# Altium project ZGAD250D12.PrjPCB
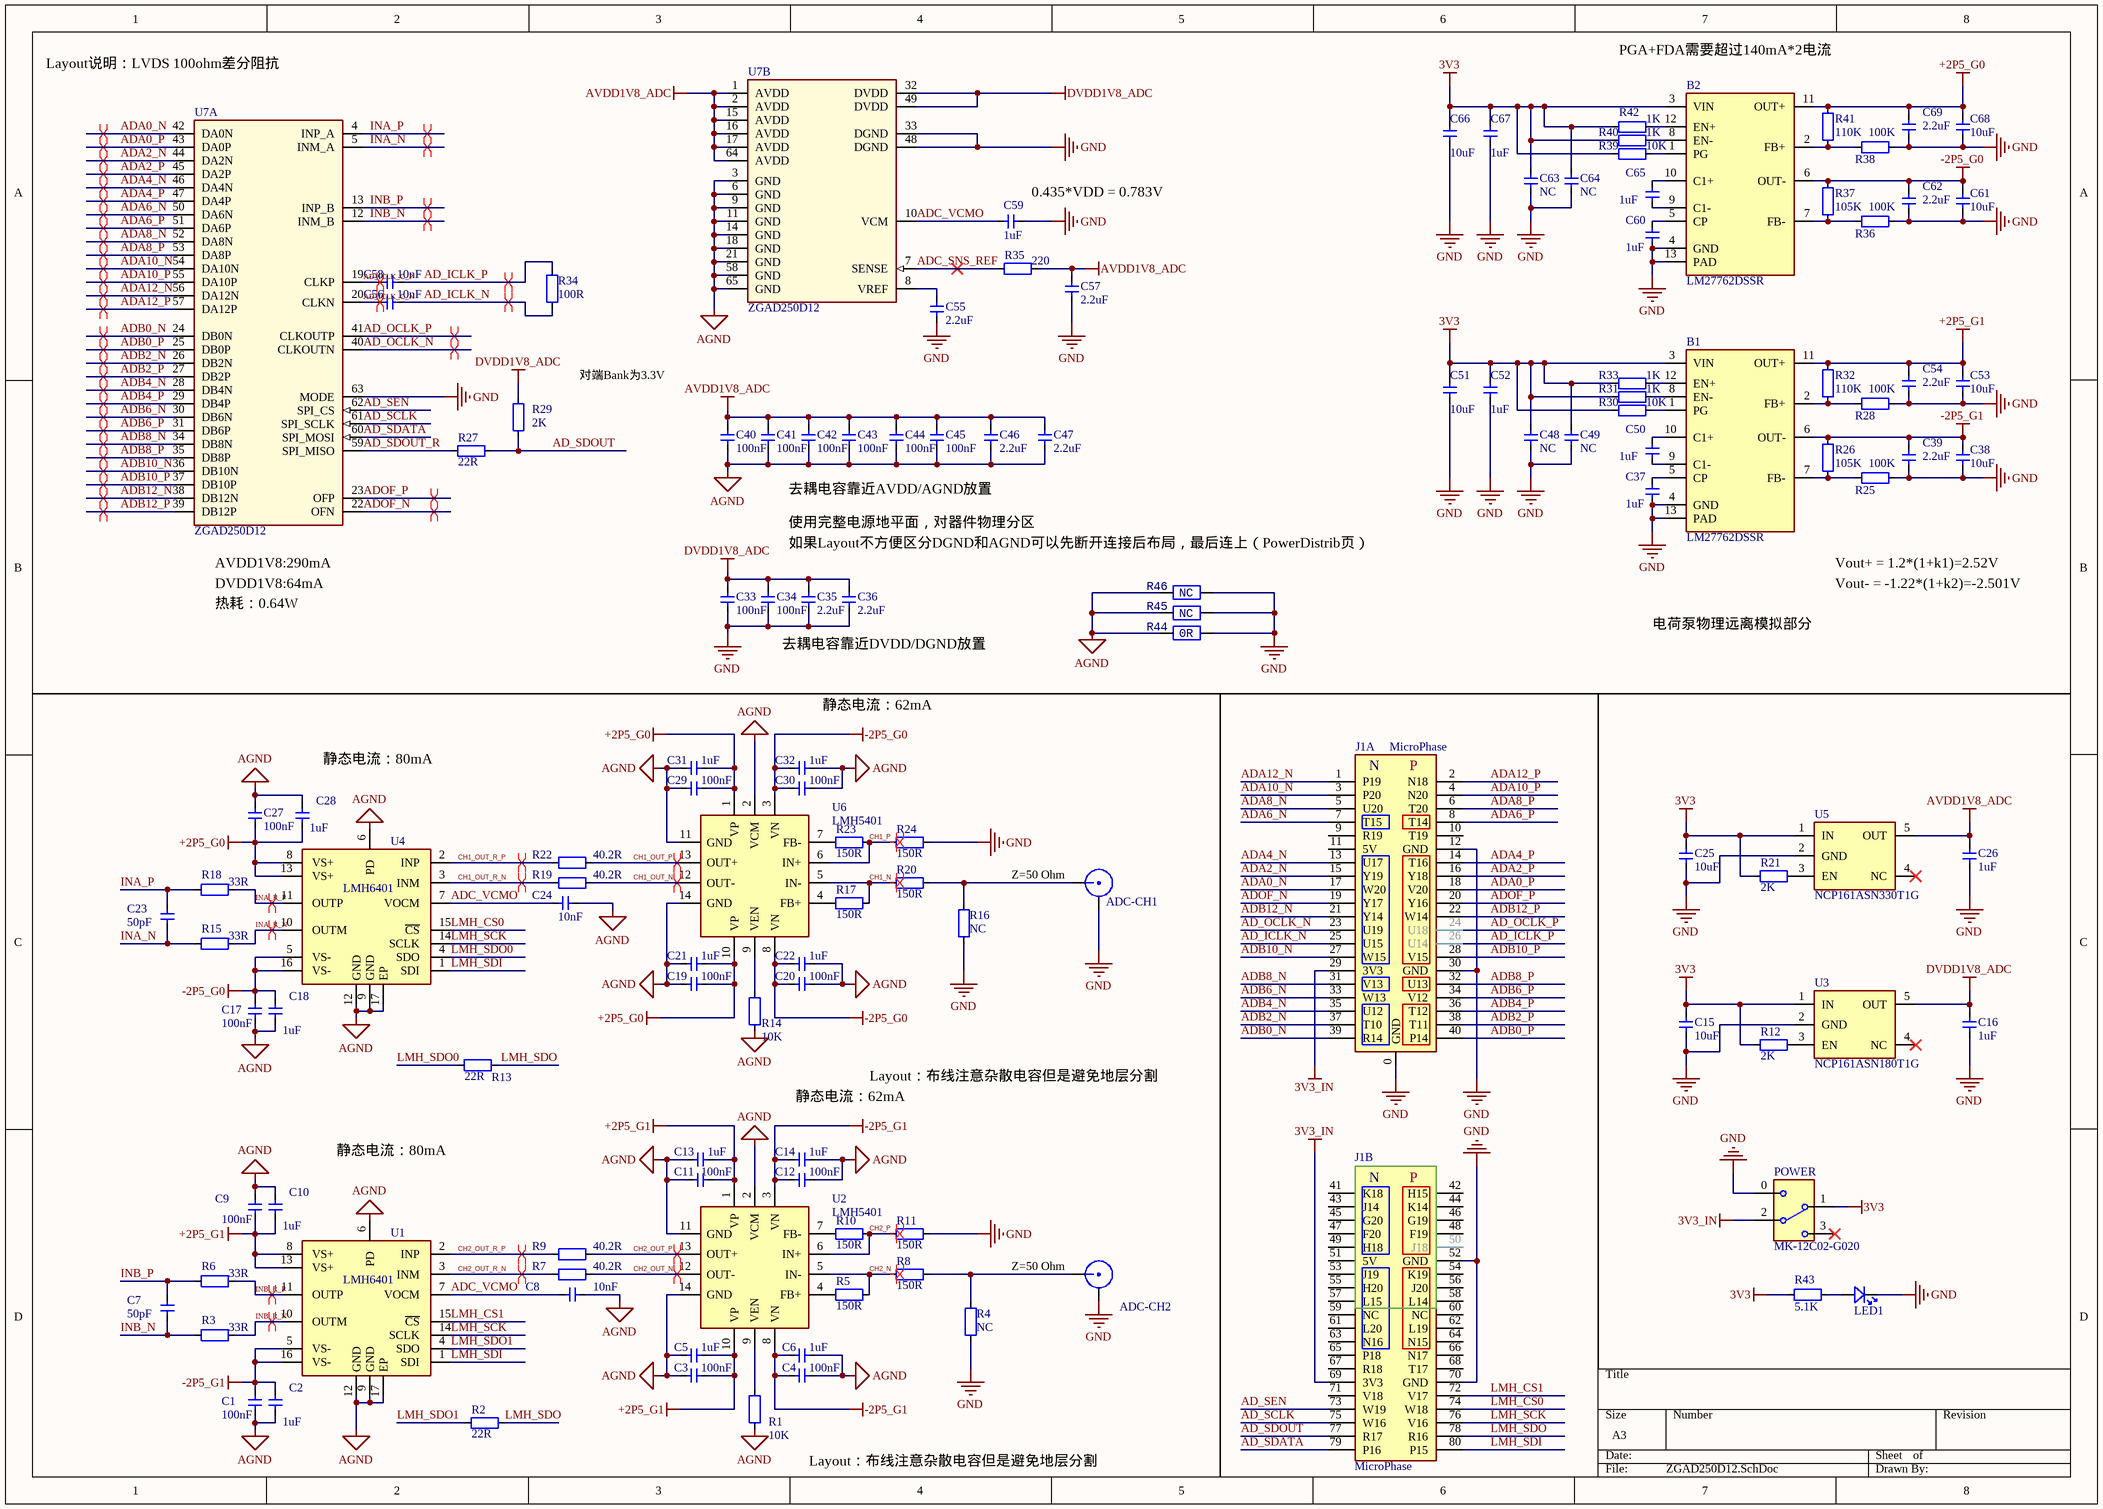
[diagram p0: ZGAD250D12.SchDoc]
1 sheet, 129 parts. Net scope: global (net labels, ports and power ports of the same name join across sheets).
Board file: ZGAD250D12.PcbDoc

## Sheet ZGAD250D12.SchDoc
size A3

### Parts
ADC-CH1  SMA  [SMA-KHD]  (value not drawn)
ADC-CH2  SMA  [SMA-KHD]  (value not drawn)
B1  LM27762DSSR  [SON50P200X300X80-13N-D]
B2  LM27762DSSR  [SON50P200X300X80-13N-D]
C1  100nF  [C 0201]
C2  1uF  [C 0402]
C3  100nF  [C 0201]
C4  100nF  [C 0201]
C5  1uF  [C 0402]
C6  1uF  [C 0402]
C7  50pF  [C 0201]
C8  10nF  [C 0201]
C9  100nF  [C 0201]
C10  1uF  [C 0402]
C11  100nF  [C 0201]
C12  100nF  [C 0201]
C13  1uF  [C 0402]
C14  1uF  [C 0402]
C15  10uF  [C 0603]
C16  1uF  [C 0402]
C17  100nF  [C 0201]
C18  1uF  [C 0402]
C19  100nF  [C 0201]
C20  100nF  [C 0201]
C21  1uF  [C 0402]
C22  1uF  [C 0402]
C23  50pF  [C 0201]
C24  10nF  [C 0201]
C25  10uF  [C 0603]
C26  1uF  [C 0402]
C27  100nF  [C 0201]
C28  1uF  [C 0402]
C29  100nF  [C 0201]
C30  100nF  [C 0201]
C31  1uF  [C 0402]
C32  1uF  [C 0402]
C33  100nF  [C 0201]
C34  100nF  [C 0201]
C35  2.2uF  [C 0603]
C36  2.2uF  [C 0603]
C37  1uF  [C 0402]
C38  10uF  [C 0603]
C39  2.2uF  [C 0402]
C40  100nF  [C 0201]
C41  100nF  [C 0201]
C42  100nF  [C 0201]
C43  100nF  [C 0201]
C44  100nF  [C 0201]
C45  100nF  [C 0201]
C46  2.2uF  [C 0603]
C47  2.2uF  [C 0603]
C48  NC  [C 0201]
C49  NC  [C 0201]
C50  1uF  [C 0402]
C51  10uF  [C 0603]
C52  1uF  [C 0402]
C53  10uF  [C 0603]
C54  2.2uF  [C 0402]
C55  2.2uF  [C 0603]
C56  10nF  [C 0201]
C57  2.2uF  [C 0603]
C58  10nF  [C 0201]
C59  1uF  [C 0402]
C60  1uF  [C 0402]
C61  10uF  [C 0603]
C62  2.2uF  [C 0402]
C63  NC  [C 0201]
C64  NC  [C 0201]
C65  1uF  [C 0402]
C66  10uF  [C 0603]
C67  1uF  [C 0402]
C68  10uF  [C 0603]
C69  2.2uF  [C 0402]
J1  MicroPhase  [MicroPhase]  (parts A,B of 2)
LED1  LED-SMD  [LED 0603W]  (value not drawn)
POWER  MK-12C02-G020  [MSK-12C01-07]
R1  10K  [R 0201]
R2  22R  [R 0201]
R3  33R  [R 0402]
R4  NC  [R 0201]
R5  150R  [R 0201]
R6  33R  [R 0402]
R7  40.2R  [R 0201]
R8  150R  [R 0201]
R9  40.2R  [R 0201]
R10  150R  [R 0201]
R11  150R  [R 0201]
R12  2K  [R 0402]
R13  22R  [R 0201]
R14  10K  [R 0201]
R15  33R  [R 0402]
R16  NC  [R 0201]
R17  150R  [R 0201]
R18  33R  [R 0402]
R19  40.2R  [R 0201]
R20  150R  [R 0201]
R21  2K  [R 0402]
R22  40.2R  [R 0201]
R23  150R  [R 0201]
R24  150R  [R 0201]
R25  100K  [R 0402]
R26  105K  [R 0402]
R27  22R  [R 0201]
R28  100K  [R 0402]
R29  2K  [R 0201]
R30  10K  [R 0402]
R31  1K  [R 0402]
R32  110K  [R 0402]
R33  1K  [R 0402]
R34  100R  [R 0201]
R35  220  [R 0201]
R36  100K  [R 0402]
R37  105K  [R 0402]
R38  100K  [R 0402]
R39  10K  [R 0402]
R40  1K  [R 0402]
R41  110K  [R 0402]
R42  1K  [R 0402]
R43  5.1K  [R 0402]
R44  0R  [R_0603]
R45  NC  [R_0603]
R46  NC  [R_0603]
U1  LMH6401  [LMH6401IRMZT]
U2  LMH5401  [LMH5401IRMSR]
U3  NCP161ASN180T1G  [SOT23-5L]
U4  LMH6401  [LMH6401IRMZT]
U5  NCP161ASN330T1G  [SOT23-5L]
U6  LMH5401  [LMH5401IRMSR]
U7  ZGAD250D12  [QFN64 9x9_L]  (parts A,B of 2)

### Nets
3V3: B1.3(VIN) B2.3(VIN) C15.2 C25.2 C48.2 C49.2 C51.2 C52.2 C63.2 C64.2 C66.2 C67.2 POWER.1 R12.2 R21.2 R30.1 R31.1 R33.1 R39.1 R40.1 R42.1 R43.1 U3.1(IN) U5.1(IN)
3V3_IN: J1.29(3V3) J1.69(3V3) POWER.2
+2P5_G0: B2.11(OUT+) C19.1 C21.1 C27.1 C28.1 C29.1 C31.1 C68.2 C69.2 R41.2 U4.8(VS+) U4.13(VS+) U6.1(VP) U6.10(VP)
+2P5_G1: B1.11(OUT+) C3.1 C5.1 C9.1 C10.1 C11.1 C13.1 C53.2 C54.2 R32.2 U1.8(VS+) U1.13(VS+) U2.1(VP) U2.10(VP)
-2P5_G0: B2.6(OUT-) C17.2 C18.2 C20.2 C22.2 C30.2 C32.2 C61.2 C62.2 R37.2 U4.5(VS-) U4.16(VS-) U6.3(VN) U6.8(VN)
-2P5_G1: B1.6(OUT-) C1.2 C2.2 C4.2 C6.2 C12.2 C14.2 C38.2 C39.2 R26.2 U1.5(VS-) U1.16(VS-) U2.3(VN) U2.8(VN)
AGND: C1.1 C2.1 C3.2 C4.1 C5.2 C6.1 C8.1 C9.2 C10.2 C11.2 C12.1 C13.2 C14.1 C17.1 C18.1 C19.2 C20.1 C21.2 C22.1 C24.1 C27.2 C28.2 C29.2 C30.1 C31.2 C32.1 C40.1 C41.1 C42.1 C43.1 C44.1 C45.1 C46.1 C47.1 R1.1 R14.1 R44.2 R45.2 R46.2 U1.6(PD) U1.9(GND) U1.12(GND) U1.17(EP) U2.2(VCM) U2.11(GND) U2.14(GND) U4.6(PD) U4.9(GND) U4.12(GND) U4.17(EP) U6.2(VCM) U6.11(GND) U6.14(GND) U7.3(GND) U7.6(GND) U7.9(GND) U7.11(GND) U7.14(GND) U7.18(GND) U7.21(GND) U7.58(GND) U7.65(GND)
AVDD1V8_ADC: C26.2 C40.2 C41.2 C42.2 C43.2 C44.2 C45.2 C46.2 C47.2 C57.2 R35.2 U5.5(OUT) U7.1(AVDD) U7.2(AVDD) U7.15(AVDD) U7.16(AVDD) U7.17(AVDD) U7.64(AVDD)
DVDD1V8_ADC: C16.2 C33.2 C34.2 C35.2 C36.2 R29.1 U3.5(OUT) U7.32(DVDD) U7.49(DVDD)
GND: ADC-CH1.2(GND) ADC-CH2.2(GND) B1.4(GND) B1.13(PAD) B2.4(GND) B2.13(PAD) C15.1 C16.1 C25.1 C26.1 C33.1 C34.1 C35.1 C36.1 C37.1 C38.1 C39.1 C48.1 C49.1 C51.1 C52.1 C53.1 C54.1 C55.1 C57.1 C59.1 C60.1 C61.1 C62.1 C63.1 C64.1 C66.1 C67.1 C68.1 C69.1 J1.0(GND) J1.12(GND) J1.30(GND) J1.52(GND) J1.70(GND) LED1.2 POWER.0 R4.2 R11.2 R16.2 R24.2 R25.1 R28.1 R36.1 R38.1 R44.1 R45.1 R46.1 U3.2(GND) U5.2(GND) U7.33(DGND) U7.48(DGND) U7.63(MODE)
AD_ICLK_C_N: C56.2 U7.20(CLKN)
AD_ICLK_C_P: C58.2 U7.19(CLKP)
AD_ICLK_N: C56.1 J1.25(U15) R34.1
AD_ICLK_P: C58.1 J1.26(U14) R34.2
AD_OCLK_N: J1.23(U19) U7.40(CLKOUTN)
AD_OCLK_P: J1.24(U18) U7.41(CLKOUTP)
AD_SCLK: J1.75(W16) U7.61(SPI_SCLK)
AD_SDATA: J1.79(P16) U7.60(SPI_MOSI)
AD_SDOUT: J1.77(R17) R27.1 R29.2
AD_SDOUT_R: R27.2 U7.59(SPI_MISO)
AD_SEN: J1.73(W19) U7.62(SPI_CS)
ADA0_N: J1.17(W20) U7.42(DA0N)
ADA0_P: J1.18(V20) U7.43(DA0P)
ADA2_N: J1.15(Y19) U7.44(DA2N)
ADA2_P: J1.16(Y18) U7.45(DA2P)
ADA4_N: J1.13(U17) U7.46(DA4N)
ADA4_P: J1.14(T16) U7.47(DA4P)
ADA6_N: J1.7(T15) U7.50(DA6N)
ADA6_P: J1.8(T14) U7.51(DA6P)
ADA8_N: J1.5(U20) U7.52(DA8N)
ADA8_P: J1.6(T20) U7.53(DA8P)
ADA10_N: J1.3(P20) U7.54(DA10N)
ADA10_P: J1.4(N20) U7.55(DA10P)
ADA12_N: J1.1(P19) U7.56(DA12N)
ADA12_P: J1.2(N18) U7.57(DA12P)
ADB0_N: J1.39(R14) U7.24(DB0N)
ADB0_P: J1.40(P14) U7.25(DB0P)
ADB2_N: J1.37(T10) U7.26(DB2N)
ADB2_P: J1.38(T11) U7.27(DB2P)
ADB4_N: J1.35(U12) U7.28(DB4N)
ADB4_P: J1.36(T12) U7.29(DB4P)
ADB6_N: J1.33(W13) U7.30(DB6N)
ADB6_P: J1.34(V12) U7.31(DB6P)
ADB8_N: J1.31(V13) U7.34(DB8N)
ADB8_P: J1.32(U13) U7.35(DB8P)
ADB10_N: J1.27(W15) U7.36(DB10N)
ADB10_P: J1.28(V15) U7.37(DB10P)
ADB12_N: J1.21(Y14) U7.38(DB12N)
ADB12_P: J1.22(W14) U7.39(DB12P)
ADC_SNS_REF: R35.1 U7.7(SENSE)
ADC_VCMO: C8.2 C24.2 C59.2 U1.7(VOCM) U4.7(VOCM) U7.10(VCM)
ADOF_N: J1.19(Y17) U7.22(OFN)
ADOF_P: J1.20(Y16) U7.23(OFP)
CH1_N: R17.1 R20.2 U6.5(IN-)
CH1_OUT_N: R19.1 U6.12(OUT-)
CH1_OUT_P: R22.1 U6.13(OUT+)
CH1_OUT_R_N: R19.2 U4.3(INM)
CH1_OUT_R_P: R22.2 U4.2(INP)
CH1_P: R23.1 R24.1 U6.6(IN+)
CH2_N: R5.1 R8.2 U2.5(IN-)
CH2_OUT_N: R7.1 U2.12(OUT-)
CH2_OUT_P: R9.1 U2.13(OUT+)
CH2_OUT_R_N: R7.2 U1.3(INM)
CH2_OUT_R_P: R9.2 U1.2(INP)
CH2_P: R10.1 R11.1 U2.6(IN+)
INA_N: C23.1 R15.2 U7.5(INM_A)
INA_P: C23.2 R18.2 U7.4(INP_A)
INA_R_N: R15.1 U4.10(OUTM)
INA_R_P: R18.1 U4.11(OUTP)
INB_N: C7.1 R3.2 U7.12(INM_B)
INB_P: C7.2 R6.2 U7.13(INP_B)
INB_R_N: R3.1 U1.10(OUTM)
INB_R_P: R6.1 U1.11(OUTP)
LMH_CS0: J1.74(W18) U4.15(~{CS})
LMH_CS1: J1.72(V17) U1.15(~{CS})
LMH_SCK: J1.76(V16) U1.14(SCLK) U4.14(SCLK)
LMH_SDI: J1.80(P15) U1.1(SDI) U4.1(SDI)
LMH_SDO: J1.78(R16) R2.1 R13.1
LMH_SDO0: R13.2 U4.4(SDO)
LMH_SDO1: R2.2 U1.4(SDO)
NetADC-CH1_1: ADC-CH1.1(IN) R16.1 R20.1
NetADC-CH2_1: ADC-CH2.1(IN) R4.1 R8.1
NetB1_1: B1.1(PG) R30.2
NetB1_2: B1.2(FB+) R28.2 R32.1
NetB1_5: B1.5(CP) C37.2
NetB1_7: B1.7(FB-) R25.2 R26.1
NetB1_8: B1.8(EN-) R31.2
NetB1_9: B1.9(C1-) C50.1
NetB1_10: B1.10(C1+) C50.2
NetB1_12: B1.12(EN+) R33.2
NetB2_1: B2.1(PG) R39.2
NetB2_2: B2.2(FB+) R38.2 R41.1
NetB2_5: B2.5(CP) C60.2
NetB2_7: B2.7(FB-) R36.2 R37.1
NetB2_8: B2.8(EN-) R40.2
NetB2_9: B2.9(C1-) C65.1
NetB2_10: B2.10(C1+) C65.2
NetB2_12: B2.12(EN+) R42.2
NetC55_2: C55.2 U7.8(VREF)
NetLED1_1: LED1.1 R43.2
NetR1_2: R1.2 U2.9(VEN)
NetR5_2: R5.2 U2.4(FB+)
NetR10_2: R10.2 U2.7(FB-)
NetR12_1: R12.1 U3.3(EN)
NetR14_2: R14.2 U6.9(VEN)
NetR17_2: R17.2 U6.4(FB+)
NetR21_1: R21.1 U5.3(EN)
NetR23_2: R23.2 U6.7(FB-)

Not connected (* = marked no-connect by the designer): J1 9(R19) 10(T19) 11(5V) 41(K18) 42(H15) 43(J14) 44(K14) 45(G20) 46(G19) 47(F20) 48(F19) 49(H18) 50(J18) 51(5V) 53(J19) 54(K19) 55(H20) 56(J20) 57(L15) 58(L14) 59(NC) 60(NC) 61(L20) 62(L19) 63(N16) 64(N15) 65(P18) 66(N17) 67(R18) 68(T17) 71(V18); POWER 3*; U3 4(NC)*; U5 4(NC)*

### Layout directives
differential pair: AD_ICLK_C_N, AD_ICLK_C_P, AD_ICLK_N, AD_ICLK_P, AD_OCLK_N, AD_OCLK_P, ADA0_N, ADA0_P, ADA2_N, ADA2_P, ADA4_N, ADA4_P, ADA6_N, ADA6_P, ADA8_N, ADA8_P, ADA10_N, ADA10_P, ADA12_N, ADA12_P, ADB0_N, ADB0_P, ADB2_N, ADB2_P, ADB4_N, ADB4_P, ADB6_N, ADB6_P, ADB8_N, ADB8_P, ADB10_N, ADB10_P, ADB12_N, ADB12_P, ADOF_N, ADOF_P, CH1_N, CH1_OUT_N, CH1_OUT_P, CH1_OUT_R_N, CH1_OUT_R_P, CH1_P, CH2_N, CH2_OUT_N, CH2_OUT_P, CH2_OUT_R_N, CH2_OUT_R_P, CH2_P, INA_N, INA_P, INA_R_N, INA_R_P, INB_N, INB_P, INB_R_N, INB_R_P

### Notes on the sheet
- Layout说明：LVDS 100ohm差分阻抗
- PGA+FDA需要超过140mA*2电流
- (near C59) 0.435*VDD = 0.783V
- 对端Bank为3.3V
- 去耦电容靠近AVDD/AGND放置
- (near U7) AVDD1V8:290mA
- DVDD1V8:64mA
- 如果Layout不方便区分DGND和AGND可以先断开连接后布局，最后连上（PowerDistrib页）
- 使用完整电源地平面，对器件物理分区
- Vout+ = 1.2*(1+k1)=2.52V
- Vout- = -1.22*(1+k2)=-2.501V
- 热耗：0.64W
- 去耦电容靠近DVDD/DGND放置
- 电荷泵物理远离模拟部分
- 静态电流：62mA
- (near C28) 静态电流：80mA
- (near ADC-CH1) Z=50 Ohm
- Layout：布线注意杂散电容但是避免地层分割
- 静态电流：80mA
- (near ADC-CH2) Z=50 Ohm
- (in symbol MicroPhase, part A) N; P
- (in symbol MicroPhase, part B) N; P

### Library data of the parts
ADC-CH1 ADC-CH2 = SMA: SMA射频接口
B1 B2 = LM27762DSSR: LDO Voltage Regulators Low-Noise Positive- and Negative-Output Integrated Switched Capacitor Plus LDO 12-WSON -40 to 85; Manufacturer_Name: Texas Instruments; Geometry.Height: 0.8mm; Mouser Part Number: 595-LM27762DSSR; Mouser Price/Stock: https://www.mouser.co.uk/ProductDetail/Texas-Instruments/LM27762DSSR?qs=vcbl%252BK4rRlfEJcC9xQ80sA%3D%3D; Manufacturer_Part_Number: LM27762DSSR; Datasheet Link: https://www.ti.com/lit/ds/symlink/lm27762.pdf
C1 C3 C4 C9 C11 C12 C17 C19 C20 C27 C29 C30 C33 C34 C40-C45 C48 C49 C63 C64 = C: GRM033Z71C104KE14D; BOM名称: 无极性贴片电容; 版权归属: 源创客; 学习资源: www.ooocke.com; 型号: GRM033Z71C104KE14D
C2 C5 C6 C10 C13 C14 C18 C21 C22 C28 C31 C32 C37 C50 C52 C59 C60 C65 C67 = C: GRM155Z71A105KE01D; BOM名称: 无极性贴片电容; 版权归属: 源创客; 学习资源: www.ooocke.com; 型号: GRM155Z71A105KE01D
C7 C23 = C: 0603CG500J500NT; BOM名称: 无极性贴片电容; 版权归属: 源创客; 学习资源: www.ooocke.com
C8 C24 C56 C58 = C: 0201B103K250NT; BOM名称: 无极性贴片电容; 版权归属: 源创客; 学习资源: www.ooocke.com
  C56 C58: 型号: 0201B103K250NT
C15 C16 C25 C26 = C: 无极性贴片电容; 版权归属: 源创客; BOM名称: 无极性贴片电容; 学习资源: www.ooocke.com
C35 C36 C46 C47 C55 C57 = C: 0603B225K250NT; BOM名称: 无极性贴片电容; 版权归属: 源创客; 学习资源: www.ooocke.com; 型号: 0603B225K250NT
C38 C51 C53 C61 C66 C68 = C: GRM188Z71A106KA73D; BOM名称: 无极性贴片电容; 版权归属: 源创客; 学习资源: www.ooocke.com; 型号: GRM188Z71A106KA73D
C39 C54 C62 C69 = C: GRM155Z71A225KE44D; BOM名称: 无极性贴片电容; 版权归属: 源创客; 学习资源: www.ooocke.com; 型号: GRM155Z71A225KE44D
J1 = MicroPhase: MicroPhase DIP接口
LED1 = LED-SMD: 贴片LED; 版权归属: 源创客; BOM名称: 贴片LED; 学习资源: www.ooocke.com
POWER = Switch-1CH-SMD_1: BOM名称: 波动开关; 版权归属: 源创客; 学习资源: www.ooocke.com
R1-R43 = R: 贴片电阻; 版权归属: 源创客; BOM名称: 贴片电阻; 学习资源: www.ooocke.com
R44-R46 = R_0603_0R: Chip Resistor 0R Jumper 0603, 1A; Manufacture PartNumber: AC0603JR-070RL; Manufacture: Yageo; NO#: 2_00001; Tolerance: Jumper; Value: 0R; Current Rating: 1A; Temperature Coefficient: -; Operating Temperature: -55°C ~ +155°C
U1 U4 = LMH6401: 4.5 GHz Ultra Wideband Digital Variable Gain Amplifier; Manufacturer_Name: Texas Instruments; Geometry.Height: 0.65mm; Mouser Part Number: 595-LMH6401IRMZT; Mouser Price/Stock: https://www.mouser.co.uk/ProductDetail/Texas-Instruments/LMH6401IRMZT?qs=zEQ6BYqA5vGEIEDmrNSRWQ%3D%3D; Manufacturer_Part_Number: LMH6401IRMZT; Datasheet Link: http://www.ti.com/lit/gpn/lmh6401
U2 U6 = LMH5401: 8-GHz, Low-Noise, Low-Power, Fully-Differential Amplifier; BOM名称: 串口转USB; 版权归属: 源创客; 学习资源: www.ooocke.com
U3 U5 = NCP161ASN500T1G
U7 = ZGAD250D12: 双通道 12 位 250Msps 的 / 模数转换器（ADC）